# EAGLE schematic Power_Dev_revA.2 (EAGLE 9.1.0)
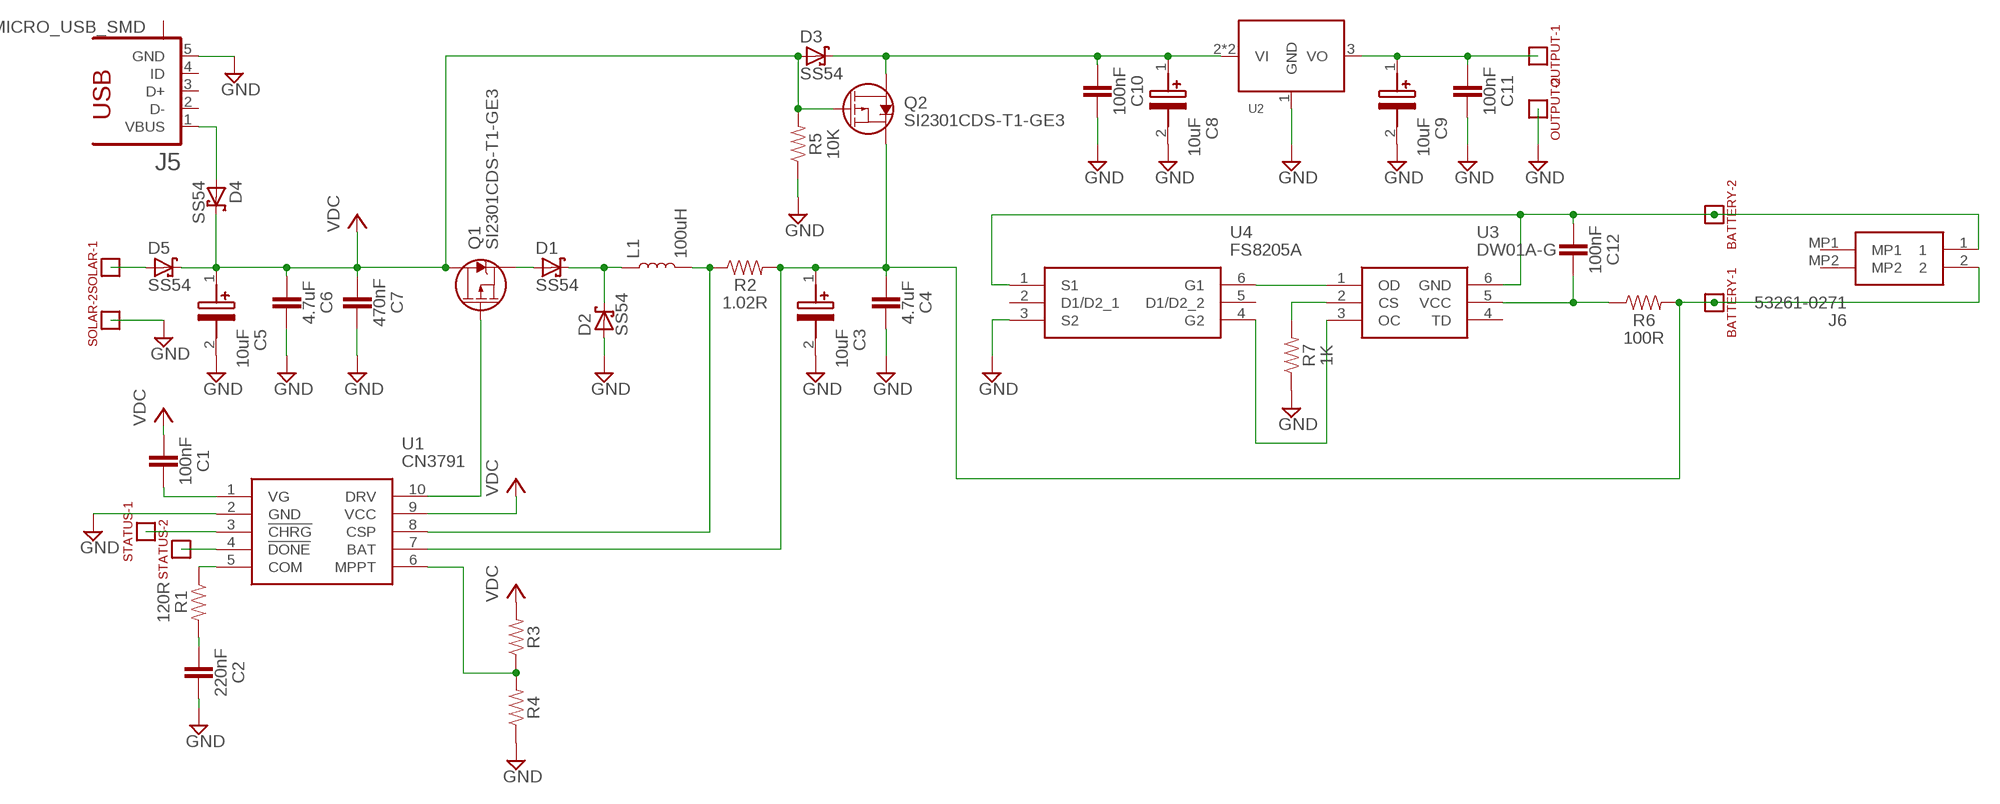
[diagram p0: schematic, sheet 1]

## Parts
BATTERY  HEADER_2PIN  [HEADER_2PIN]
C1  100nF  C_0402  [0402]
C2  220nF  C_0603  [0603]
C3  10uF  6.3MM_SMD_ECAP  [6MM_SMD_ECAP]
C4  4.7uF  C_1206  [1206]
C5  10uF  6.3MM_SMD_ECAP  [6MM_SMD_ECAP]
C6  4.7uF  C_1206  [1206]
C7  470nF  C_0805  [0805]
C8  10uF  6.3MM_SMD_ECAP  [6MM_SMD_ECAP]
C9  10uF  6.3MM_SMD_ECAP  [6MM_SMD_ECAP]
C10  100nF  C_0402  [0402]
C11  100nF  C_0402  [0402]
C12  100nF  C_0402  [0402]
D1  SS54  DIODE_SCHOTTKY_SMA  [SMA(DO-214AC)]
D2  SS54  DIODE_SCHOTTKY_SMA  [SMA(DO-214AC)]
D3  SS54  DIODE_SCHOTTKY_SMA  [SMA(DO-214AC)]
D4  SS54  DIODE_SCHOTTKY_SMA  [SMA(DO-214AC)]
D5  SS54  DIODE_SCHOTTKY_SMA  [SMA(DO-214AC)]
J5  MICRO_USB_SMD  [10118192-0002LF]
J6  53261-0271  [532610271]
L1  100uH  L_SMD,7X7.8MM  [L_SMD,7X7.8MM]
OUTPUT  HEADER_2PIN  [HEADER_2PIN]
Q1  SI2301CDS-T1-GE3  MOSFET_P_SOT23  [SOT-23]
Q2  SI2301CDS-T1-GE3  MOSFET_P_SOT23  [SOT-23]
R1  120R  R_0805  [0805]
R2  1.02R  R_1206  [1206]
R3  RESISTOR_TH  [RESISTOR_TH]
R4  RESISTOR_TH  [RESISTOR_TH]
R5  10K  R_0402  [0402]
R6  100R  R_0402  [0402]
R7  1K  R_0402  [0402]
SOLAR  HEADER_2PIN  [HEADER_2PIN]
STATUS  HEADER_2PIN  [HEADER_2PIN]
U1  CN3791  [SOP100P600X175-10N]
U2  LDO_SOT89  [SOT-89-3]
U3  DW01A-G  [SOT95P280X135-6N]
U4  FS8205A  [SOT95P280X125-6N]

## Nets
GND: C2.2 C3.2(-) C4.2 C5.2(-) C6.2 C7.2 C8.2(-) C9.2(-) C10.2 C11.2 D2.2(A) J5.5(GND) OUTPUT.P$2 R4.P$1 R5.1 R7.1 SOLAR.P$2 U1.2(GND) U2.1(GND) U4.3(S2)
N$1: D4.2(A) J5.1(VBUS)
N$2: D5.2(A) SOLAR.P$1
N$3: D1.2(A) Q1.3(S)
N$4: D1.1(C) D2.1(C) L1.P$1
N$5: L1.P$2 R2.1 U1.8(CSP)
N$6: C9.1(+) C11.1 OUTPUT.P$1 U2.3(VO)
N$7: Q1.1(G) U1.10(DRV)
N$8: C8.1(+) C10.1 D3.1(C) Q2.2(D) U2.2(VI) U2.4(VI)
N$9: R1.1 U1.5(COM)
N$10: C2.1 R1.2
N$11: STATUS.P$1 U1.3(!CHRG)
N$12: STATUS.P$2 U1.4(!DONE)
N$13: C1.2 U1.1(VG)
N$14: R3.P$1 R4.P$2 U1.6(MPPT)
N$15: R7.2 U3.2(CS)
N$16: U3.3(OC) U4.4(G2)
N$17: U3.1(OD) U4.6(G1)
N$18: BATTERY.P$2 C12.1 J6.1 U3.6(GND) U4.1(S1)
N$19: C12.2 R6.1 U3.5(VCC)
N$20: BATTERY.P$1 C3.1(+) C4.1 J6.2 Q2.3(S) R2.2 R6.2 U1.7(BAT)
VDC: C1.1 C5.1(+) C6.1 C7.1 D3.2(A) D4.1(C) D5.1(C) Q1.2(D) Q2.1(G) R3.P$2 R5.2 U1.9(VCC)
Unconnected: J5.2(D-) J5.3(D+) J5.4(ID) J5.S1 J6.MP1 J6.MP2 U3.4(TD) U4.2(D1/D2_1) U4.5(D1/D2_2)

## Library data of the parts
BATTERY OUTPUT SOLAR STATUS = NSE LABS:HEADER_2PIN
C1 C10-C12 = NSE LABS:C_0402: Samsung Source: Datasheet <https://datasheet.lcsc.com/szlcsc/Samsung-Electro-Mechanics-CL05B104KB54PNC_C307331.pdf>
C2 = NSE LABS:C_0603
C3 C5 C8 C9 = NSE LABS:6.3MM_SMD_ECAP
C4 C6 = NSE LABS:C_1206
C7 = NSE LABS:C_0805
D1-D5 = NSE LABS:DIODE_SCHOTTKY_SMA
J5 = NSE LABS:MICRO_USB_SMD: Receptacle, micro-USB, type A/B Tyco Electronics
J6 = NSE LABS:53261-0271: 1.25mm Pitch, PicoBlade PCB Header, Single Row, Right-Angle, Surface Mount, Tin (Sn) Plating, Friction Lock, Circuits, Tape and Reel Source: Datasheet <https://www.molex.com/pdm_docs/sd/532610271_sd.pdf>; ARROW_PART_NUMBER: 53261-0271; ARROW_PRICE-STOCK: https://www.arrow.com/en/products/53261-0271/molex?region=nac; DESCRIPTION: 1.25mm Pitch, PicoBlade PCB Header, Single Row, Right-Angle, Surface Mount, Tin (Sn) Plating, Friction Lock, Circuits, Tape and Reel; HEIGHT: 3.65mm; MANUFACTURER_NAME: Molex; MANUFACTURER_PART_NUMBER: 53261-0271; MOUSER_PART_NUMBER: 538-53261-0271; MOUSER_PRICE-STOCK: https://www.mouser.co.uk/ProductDetail/Molex/53261-0271?qs=%252B72YyncTwW%252B8%252BBjraxGf3A%3D%3D
L1 = NSE LABS:L_SMD,7X7.8MM
Q1 Q2 = NSE LABS:MOSFET_P_SOT23
R1 = NSE LABS:R_0805
R2 = NSE LABS:R_1206
R3 R4 = NSE LABS:RESISTOR_TH
R5-R7 = NSE LABS:R_0402
U1 = NSE LABS:CN3791: ic Source: Datasheet <http://www.consonance-elec.com/pdf/datasheet/DSE-CN3791.pdf>; DESCRIPTION: ic; HEIGHT: 1.75mm; MANUFACTURER_NAME: Consonance; MANUFACTURER_PART_NUMBER: CN3791
U2 = NSE LABS:LDO_SOT89
U3 = NSE LABS:DW01A-G: One Cell Lithium-ion/Polymer Battery Protection IC Source: Datasheet <http://acoptex.com/uploads/DW01A.pdf>; DESCRIPTION: One Cell Lithium-ion/Polymer Battery Protection IC; HEIGHT: 1.35mm; MANUFACTURER_NAME: Fortune Semiconductor Corporation; MANUFACTURER_PART_NUMBER: DW01A-G
U4 = NSE LABS:FS8205A: Dual N-Channel Enhancement Power Mosfet Source: Datasheet <http://www.techpublic.com.tw/pdf/FS8205A.pdf>; DESCRIPTION: Dual N-Channel Enhancement Power Mosfet; HEIGHT: 1.25mm; MANUFACTURER_NAME: TECH PUBLIC; MANUFACTURER_PART_NUMBER: FS8205A